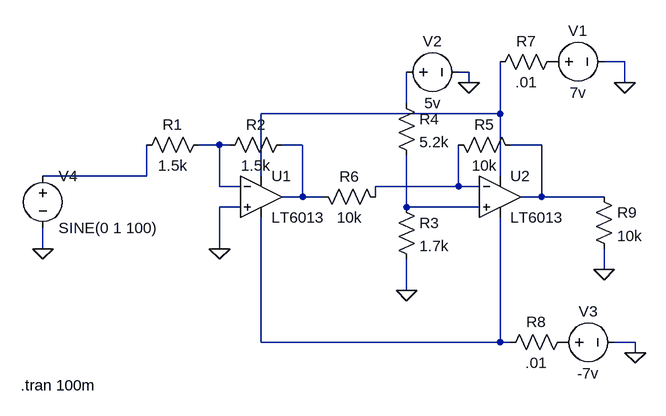
[diagram p0: schematic Final-with-LT6013.asc]
Final-with-LT6013.asc, the LTspice schematic file:
Version 4
SHEET 1 880 680
WIRE 608 -64 576 -64
WIRE 368 -48 352 -48
WIRE 368 -32 368 -48
WIRE 608 -32 608 -64
WIRE 272 0 272 -48
WIRE 416 16 416 -64
WIRE 416 16 48 16
WIRE -16 64 -48 64
WIRE 0 64 -16 64
WIRE 112 64 80 64
WIRE 480 64 432 64
WIRE -128 112 -128 64
WIRE -128 112 -288 112
WIRE 48 112 48 16
WIRE 416 112 416 16
WIRE -16 128 -16 64
WIRE 16 128 -16 128
WIRE 352 128 352 64
WIRE 352 128 224 128
WIRE 384 128 352 128
WIRE 112 144 112 64
WIRE 112 144 80 144
WIRE 144 144 112 144
WIRE 224 144 224 128
WIRE 480 144 480 64
WIRE 480 144 448 144
WIRE 576 144 480 144
WIRE 16 160 -16 160
WIRE 272 160 272 80
WIRE 384 160 272 160
WIRE -288 224 -288 192
WIRE -16 224 -16 160
WIRE 576 256 576 224
WIRE 272 288 272 240
WIRE 48 368 48 176
WIRE 416 368 416 176
WIRE 416 368 48 368
WIRE 432 368 416 368
WIRE 624 368 592 368
WIRE 624 384 624 368
FLAG 272 288 0
FLAG -16 224 0
FLAG 608 -32 0
FLAG 624 384 0
FLAG 368 -32 0
FLAG -288 224 0
FLAG 576 256 0
SYMBOL Opamps\\LT6013 48 144 R0
SYMATTR InstName U1
SYMBOL Opamps\\LT6013 416 144 R0
SYMATTR InstName U2
SYMBOL res -144 80 R270
WINDOW 0 32 56 VTop 2
WINDOW 3 0 56 VBottom 2
SYMATTR InstName R1
SYMATTR Value 1.5k
SYMBOL res -16 80 R270
WINDOW 0 32 56 VTop 2
WINDOW 3 0 56 VBottom 2
SYMATTR InstName R2
SYMATTR Value 1.5k
SYMBOL res 256 144 R0
SYMATTR InstName R3
SYMATTR Value 1.7k
SYMBOL res 256 -16 R0
SYMATTR InstName R4
SYMATTR Value 5.2k
SYMBOL res 448 80 M270
WINDOW 0 32 56 VTop 2
WINDOW 3 0 56 VBottom 2
SYMATTR InstName R5
SYMATTR Value 10k
SYMBOL res 240 160 M270
WINDOW 0 32 56 VTop 2
WINDOW 3 0 56 VBottom 2
SYMATTR InstName R6
SYMATTR Value 10k
SYMBOL voltage 480 -64 R270
WINDOW 0 32 56 VTop 2
WINDOW 3 -32 56 VBottom 2
WINDOW 123 0 0 Left 2
WINDOW 39 0 0 Left 2
SYMATTR InstName V1
SYMATTR Value 7v
SYMBOL voltage 256 -48 R270
WINDOW 0 32 56 VTop 2
WINDOW 3 -32 56 VBottom 2
WINDOW 123 0 0 Left 2
WINDOW 39 0 0 Left 2
SYMATTR InstName V2
SYMATTR Value 5v
SYMBOL voltage 496 368 R270
WINDOW 0 32 56 VTop 2
WINDOW 3 -32 56 VBottom 2
WINDOW 123 0 0 Left 2
WINDOW 39 0 0 Left 2
SYMATTR InstName V3
SYMATTR Value -7v
SYMBOL voltage -288 96 R0
WINDOW 123 0 0 Left 2
WINDOW 39 0 0 Left 2
SYMATTR InstName V4
SYMATTR Value SINE(0 1 100)
SYMBOL res 400 -48 R270
WINDOW 0 32 56 VTop 2
WINDOW 3 0 56 VBottom 2
SYMATTR InstName R7
SYMATTR Value .01
SYMBOL res 416 384 R270
WINDOW 0 32 56 VTop 2
WINDOW 3 0 56 VBottom 2
SYMATTR InstName R8
SYMATTR Value .01
SYMBOL res 560 128 R0
SYMATTR InstName R9
SYMATTR Value 10k
TEXT -322 434 Left 2 !.tran 100m

The netlist it stands for:
* Final-with-LT6013.asc
* U1: LT6013 (symbol Opamps\LT6013 not available, pins judged from their places): In+=0 In-=N003 V+=N002 V-=N009 OUT=N004
* U2: LT6013 (symbol Opamps\LT6013 not available, pins judged from their places): In+=N008 In-=N007 V+=N002 V-=N009 OUT=N005
R1 N006 N003 1.5k
R2 N003 N004 1.5k
R3 N008 0 1.7k
R4 N001 N008 5.2k
R5 N005 N007 10k
R6 N007 N004 10k
V1 P001 0 7v
V2 N001 0 5v
V3 P002 0 -7v
V4 N006 0 SINE(0 1 100)
R7 N002 P001 .01
R8 N009 P002 .01
R9 N005 0 10k
.tran 100m
.backanno
.end